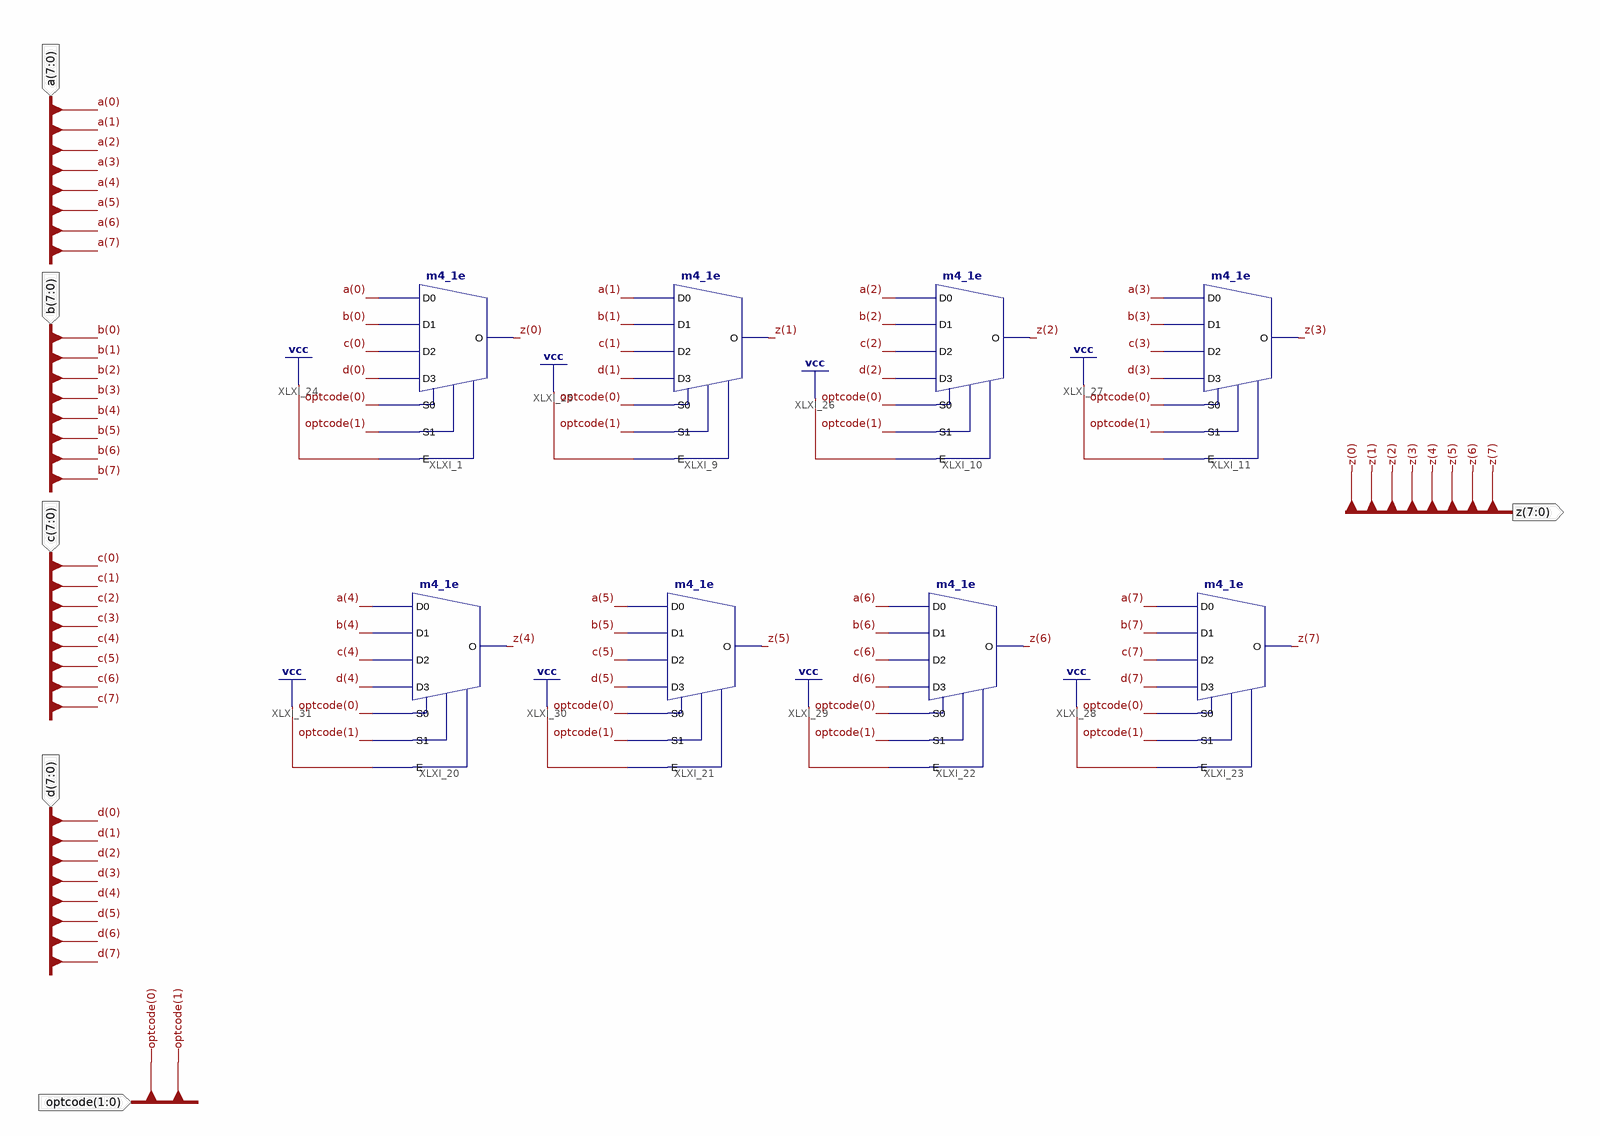
[diagram p0: schematic sheet 1]
// Xilinx ISE schematic readPortMux.sch (spartan6) as structural Verilog: 8 symbols, 6 ports
module readPortMux (
  input  [7:0] a,
  input  [7:0] b,
  input  [7:0] c,
  input  [7:0] d,
  input  [1:0] optcode,
  output [7:0] z
);

  m4_1e XLXI_1 (.D0(a[0]), .D1(b[0]), .D2(c[0]), .D3(d[0]), .E(1'b1), .S0(optcode[0]), .S1(optcode[1]), .O(z[0]));
  m4_1e XLXI_9 (.D0(a[1]), .D1(b[1]), .D2(c[1]), .D3(d[1]), .E(1'b1), .S0(optcode[0]), .S1(optcode[1]), .O(z[1]));
  m4_1e XLXI_10 (.D0(a[2]), .D1(b[2]), .D2(c[2]), .D3(d[2]), .E(1'b1), .S0(optcode[0]), .S1(optcode[1]), .O(z[2]));
  m4_1e XLXI_11 (.D0(a[3]), .D1(b[3]), .D2(c[3]), .D3(d[3]), .E(1'b1), .S0(optcode[0]), .S1(optcode[1]), .O(z[3]));
  m4_1e XLXI_20 (.D0(a[4]), .D1(b[4]), .D2(c[4]), .D3(d[4]), .E(1'b1), .S0(optcode[0]), .S1(optcode[1]), .O(z[4]));
  m4_1e XLXI_21 (.D0(a[5]), .D1(b[5]), .D2(c[5]), .D3(d[5]), .E(1'b1), .S0(optcode[0]), .S1(optcode[1]), .O(z[5]));
  m4_1e XLXI_22 (.D0(a[6]), .D1(b[6]), .D2(c[6]), .D3(d[6]), .E(1'b1), .S0(optcode[0]), .S1(optcode[1]), .O(z[6]));
  m4_1e XLXI_23 (.D0(a[7]), .D1(b[7]), .D2(c[7]), .D3(d[7]), .E(1'b1), .S0(optcode[0]), .S1(optcode[1]), .O(z[7]));
endmodule
